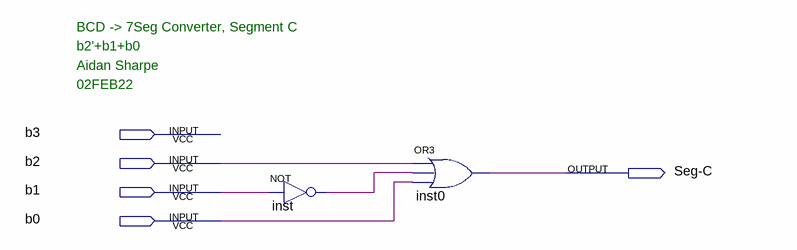
[diagram p0: schematic sheet]
// Quartus schematic BCD_7Seg_C.bdf as structural Verilog: 2 symbols, 5 pins
module BCD_7Seg_C (
  input  b3,
  input  b2,
  input  b1,
  input  b0,
  output \Seg-C 
);

  wire inst_out;

  not inst (inst_out, b1);
  or inst0 (\Seg-C , b2, inst_out, b0);

  // Notes on the sheet:
  //   BCD -> 7Seg Converter, Segment C
  //   b2'+b1+b0
  //   Aidan Sharpe
  //   02FEB22
endmodule
